# Altium schematic sheet compas_heds_mouse.SCHDOC
size A4
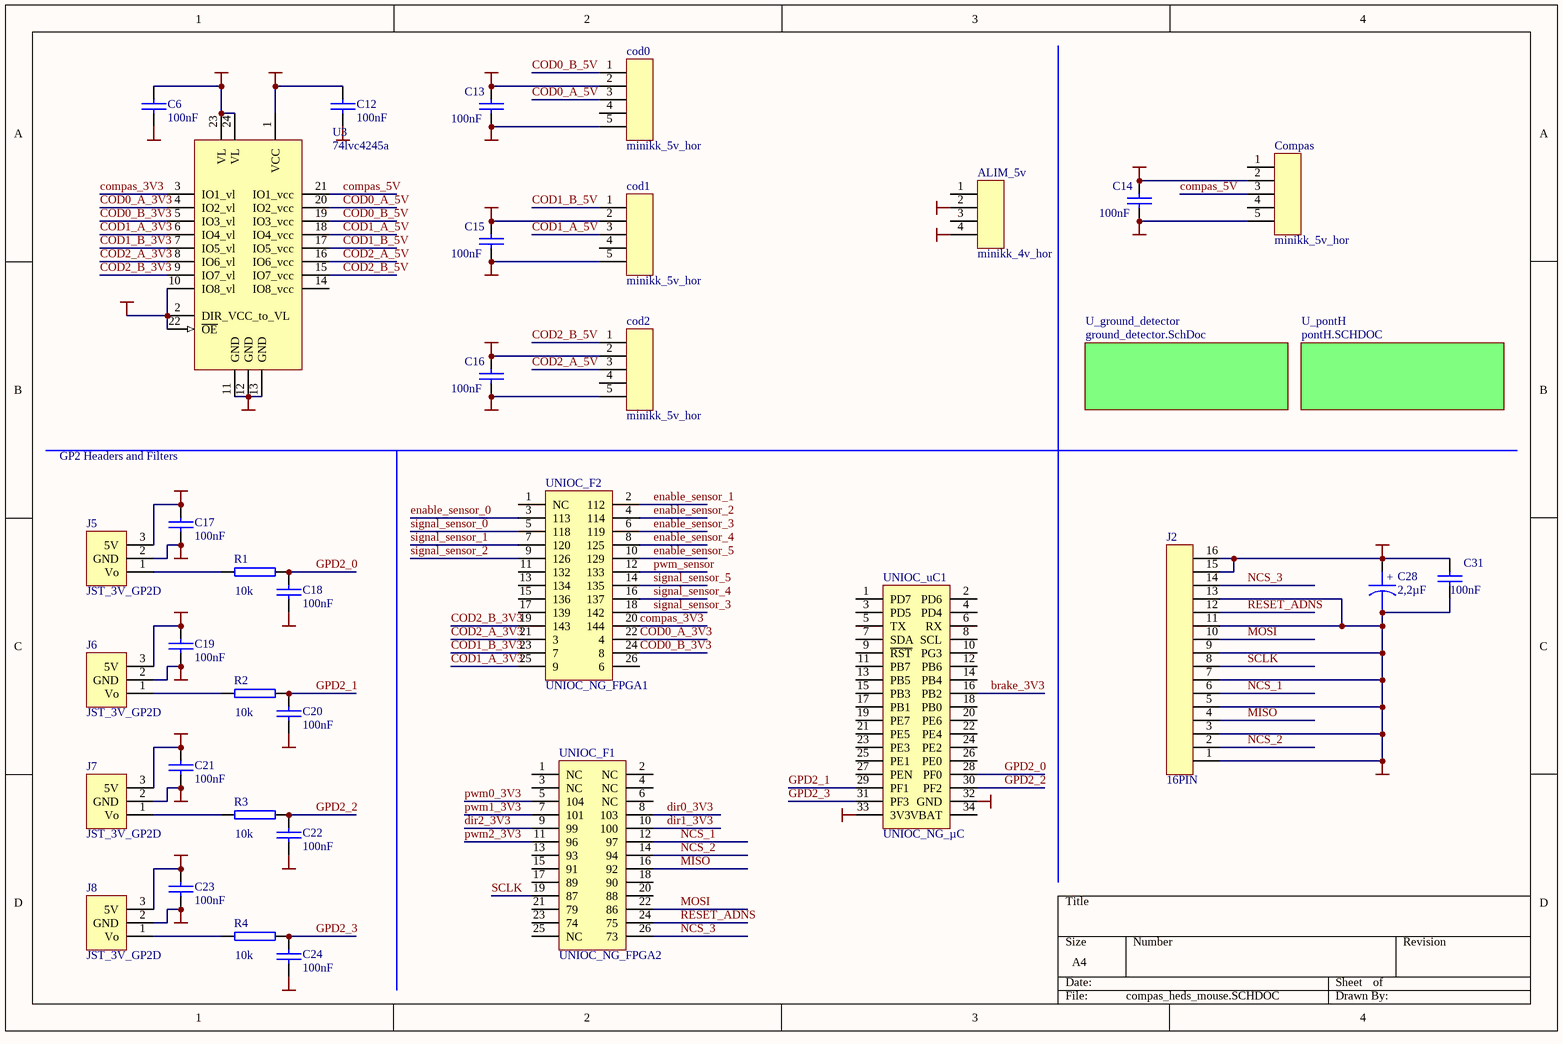
[diagram p0: compas_heds_mouse.SCHDOC]

## Parts
ALIM_5v  minikk_4v_hor  [con_mini_kk_4h]
C6  100nF  [0805]
C12  100nF  [TCONDO]
C13  100nF  [TCONDO]
C14  100nF  [TCONDO]
C15  100nF  [TCONDO]
C16  100nF  [TCONDO]
C17  100nF  [TCONDO]
C18  100nF  [TCONDO]
C19  100nF  [TCONDO]
C20  100nF  [TCONDO]
C21  100nF  [TCONDO]
C22  100nF  [TCONDO]
C23  100nF  [TCONDO]
C24  100nF  [TCONDO]
C28  2,2µF  [1210]
C31  100nF  [0805]
cod0  minikk_5v_hor  [con_mini_kk_5h]
cod1  minikk_5v_hor  [con_mini_kk_5h]
cod2  minikk_5v_hor  [con_mini_kk_5h]
Compas  minikk_5v_hor  [con_mini_kk_5h]
J2  16PIN  [HE10-16V]
J5  JST_3V_GP2D  [CON_GP2_V]
J6  JST_3V_GP2D  [CON_GP2_V]
J7  JST_3V_GP2D  [CON_GP2_V]
J8  JST_3V_GP2D  [CON_GP2_V]
R1  10k  [0805]
R2  10k  [0805]
R3  10k  [0805]
R4  10k  [0805]
U3  74lvc4245a  [SSOP24]
UNIOC_F1  UNIOC_NG_FPGA2  [TCON26]
UNIOC_F2  UNIOC_NG_FPGA1  [TCON26]
UNIOC_uC1  UNIOC_NG_µC  [TCON34]

## Sub-sheets
U_ground_detector = ground_detector.SchDoc: no entries
U_pontH = pontH.SCHDOC: no entries

## Nets
3V3: C6.1 C28.1 C31.1 J2.15 J2.16 U3.2(DIR_VCC_to_VL) U3.10(IO8_vl) U3.22(~{OE}) U3.23(VL) U3.24(VL) UNIOC_uC1.33(3V3)
5V: ALIM_5v.4 C12.1 C13.1 C14.1 C15.1 C16.1 C17.1 C19.1 C21.1 C23.1 cod0.2 cod1.2 cod2.2 Compas.2 J5.3(5V) J6.3(5V) J7.3(5V) J8.3(5V) U3.1(VCC)
GND: ALIM_5v.2 C6.2 C12.2 C13.2 C14.2 C15.2 C16.2 C17.2 C18.2 C19.2 C20.2 C21.2 C22.2 C23.2 C24.2 C28.2 C31.2 cod0.5 cod1.5 cod2.5 Compas.5 J2.1 J2.3 J2.5 J2.7 J2.9 J2.11 J2.13 J5.2(GND) J6.2(GND) J7.2(GND) J8.2(GND) U3.11(GND) U3.12(GND) U3.13(GND) UNIOC_uC1.32(GND)
brake_3V3: UNIOC_uC1.16(PB2)
COD0_A_3V3: U3.4(IO2_vl) UNIOC_F2.22(4)
COD0_A_5V: cod0.3 U3.20(IO2_vcc)
COD0_B_3V3: U3.5(IO3_vl) UNIOC_F2.24(8)
COD0_B_5V: cod0.1 U3.19(IO3_vcc)
COD1_A_3V3: U3.6(IO4_vl) UNIOC_F2.25(9)
COD1_A_5V: cod1.3 U3.18(IO4_vcc)
COD1_B_3V3: U3.7(IO5_vl) UNIOC_F2.23(7)
COD1_B_5V: cod1.1 U3.17(IO5_vcc)
COD2_A_3V3: U3.8(IO6_vl) UNIOC_F2.21(3)
COD2_A_5V: cod2.3 U3.16(IO6_vcc)
COD2_B_3V3: U3.9(IO7_vl) UNIOC_F2.19(143)
COD2_B_5V: cod2.1 U3.15(IO7_vcc)
compas_3V3: U3.3(IO1_vl) UNIOC_F2.20(144)
compas_5V: Compas.3 U3.21(IO1_vcc)
dir0_3V3: UNIOC_F1.8(103)
dir1_3V3: UNIOC_F1.10(100)
dir2_3V3: UNIOC_F1.9(99)
enable_sensor_0: UNIOC_F2.3(113)
enable_sensor_1: UNIOC_F2.2(112)
enable_sensor_2: UNIOC_F2.4(114)
enable_sensor_3: UNIOC_F2.6(119)
enable_sensor_4: UNIOC_F2.8(125)
enable_sensor_5: UNIOC_F2.10(129)
GPD2_0: C18.1 R1.2 UNIOC_uC1.28(PF0)
GPD2_1: C20.1 R2.2 UNIOC_uC1.29(PF1)
GPD2_2: C22.1 R3.2 UNIOC_uC1.30(PF2)
GPD2_3: C24.1 R4.2 UNIOC_uC1.31(PF3)
MISO: J2.4 UNIOC_F1.16(92)
MOSI: J2.10 UNIOC_F1.22(86)
NCS_1: J2.6 UNIOC_F1.12(97)
NCS_2: J2.2 UNIOC_F1.14(94)
NCS_3: J2.14 UNIOC_F1.26(73)
pwm0_3V3: UNIOC_F1.5(104)
pwm1_3V3: UNIOC_F1.7(101)
pwm2_3V3: UNIOC_F1.11(96)
pwm_sensor: UNIOC_F2.12(133)
RESET_ADNS: J2.12 UNIOC_F1.24(75)
SCLK: J2.8 UNIOC_F1.19(87)
signal_sensor_0: UNIOC_F2.5(118)
signal_sensor_1: UNIOC_F2.7(120)
signal_sensor_2: UNIOC_F2.9(126)
signal_sensor_3: UNIOC_F2.18(142)
signal_sensor_4: UNIOC_F2.16(137)
signal_sensor_5: UNIOC_F2.14(135)
NetJ5_1: J5.1(Vo) R1.1
NetJ6_1: J6.1(Vo) R2.1
NetJ7_1: J7.1(Vo) R3.1
NetJ8_1: J8.1(Vo) R4.1

Not connected (* = marked no-connect by the designer): ALIM_5v 1 3; cod0 4; cod1 4; cod2 4; Compas 1 4; U3 14(IO8_vcc); UNIOC_F1 1(NC) 2(NC) 3(NC) 4(NC) 6(NC) 13(93) 15(91) 17(89) 18(90) 20(88) 21(79) 23(74) 25(NC); UNIOC_F2 1(NC) 11(132) 13(134) 15(136) 17(139) 26(6); UNIOC_uC1 1(PD7) 2(PD6) 3(PD5) 4(PD4) 5(TX) 6(RX) 7(SDA) 8(SCL) 9(~{RST}) 10(PG3) 11(PB7) 12(PB6) 13(PB5) 14(PB4) 15(PB3) 17(PB1) 18(PB0) 19(PE7) 20(PE6) 21(PE5) 22(PE4) 23(PE3) 24(PE2) 25(PE1) 26(PE0) 27(PEN) 34(VBAT)

## Notes on the sheet
- GP2 Headers and Filters
- (in symbol CAPACITOR POL) +

## Library data of the parts
ALIM_5v = con_mini_kk_4h: connecteur mini kk 4voies horizontal
C6 C12-C24 = CONDO
C28 = CAPACITOR POL
C31 = TCONDO
cod0-cod2 Compas = con_mini_kk_5h: connecteur mini kk 5 voies horizontal
J5-J8 = con_gp2: ref FN : 949-2429 connecteur JST utilisé dans les GP2D*
R1-R4 = RES
U3 = 74ALVC4245: octal voltage transceiver